# Altium project X-Fly.PrjPcb
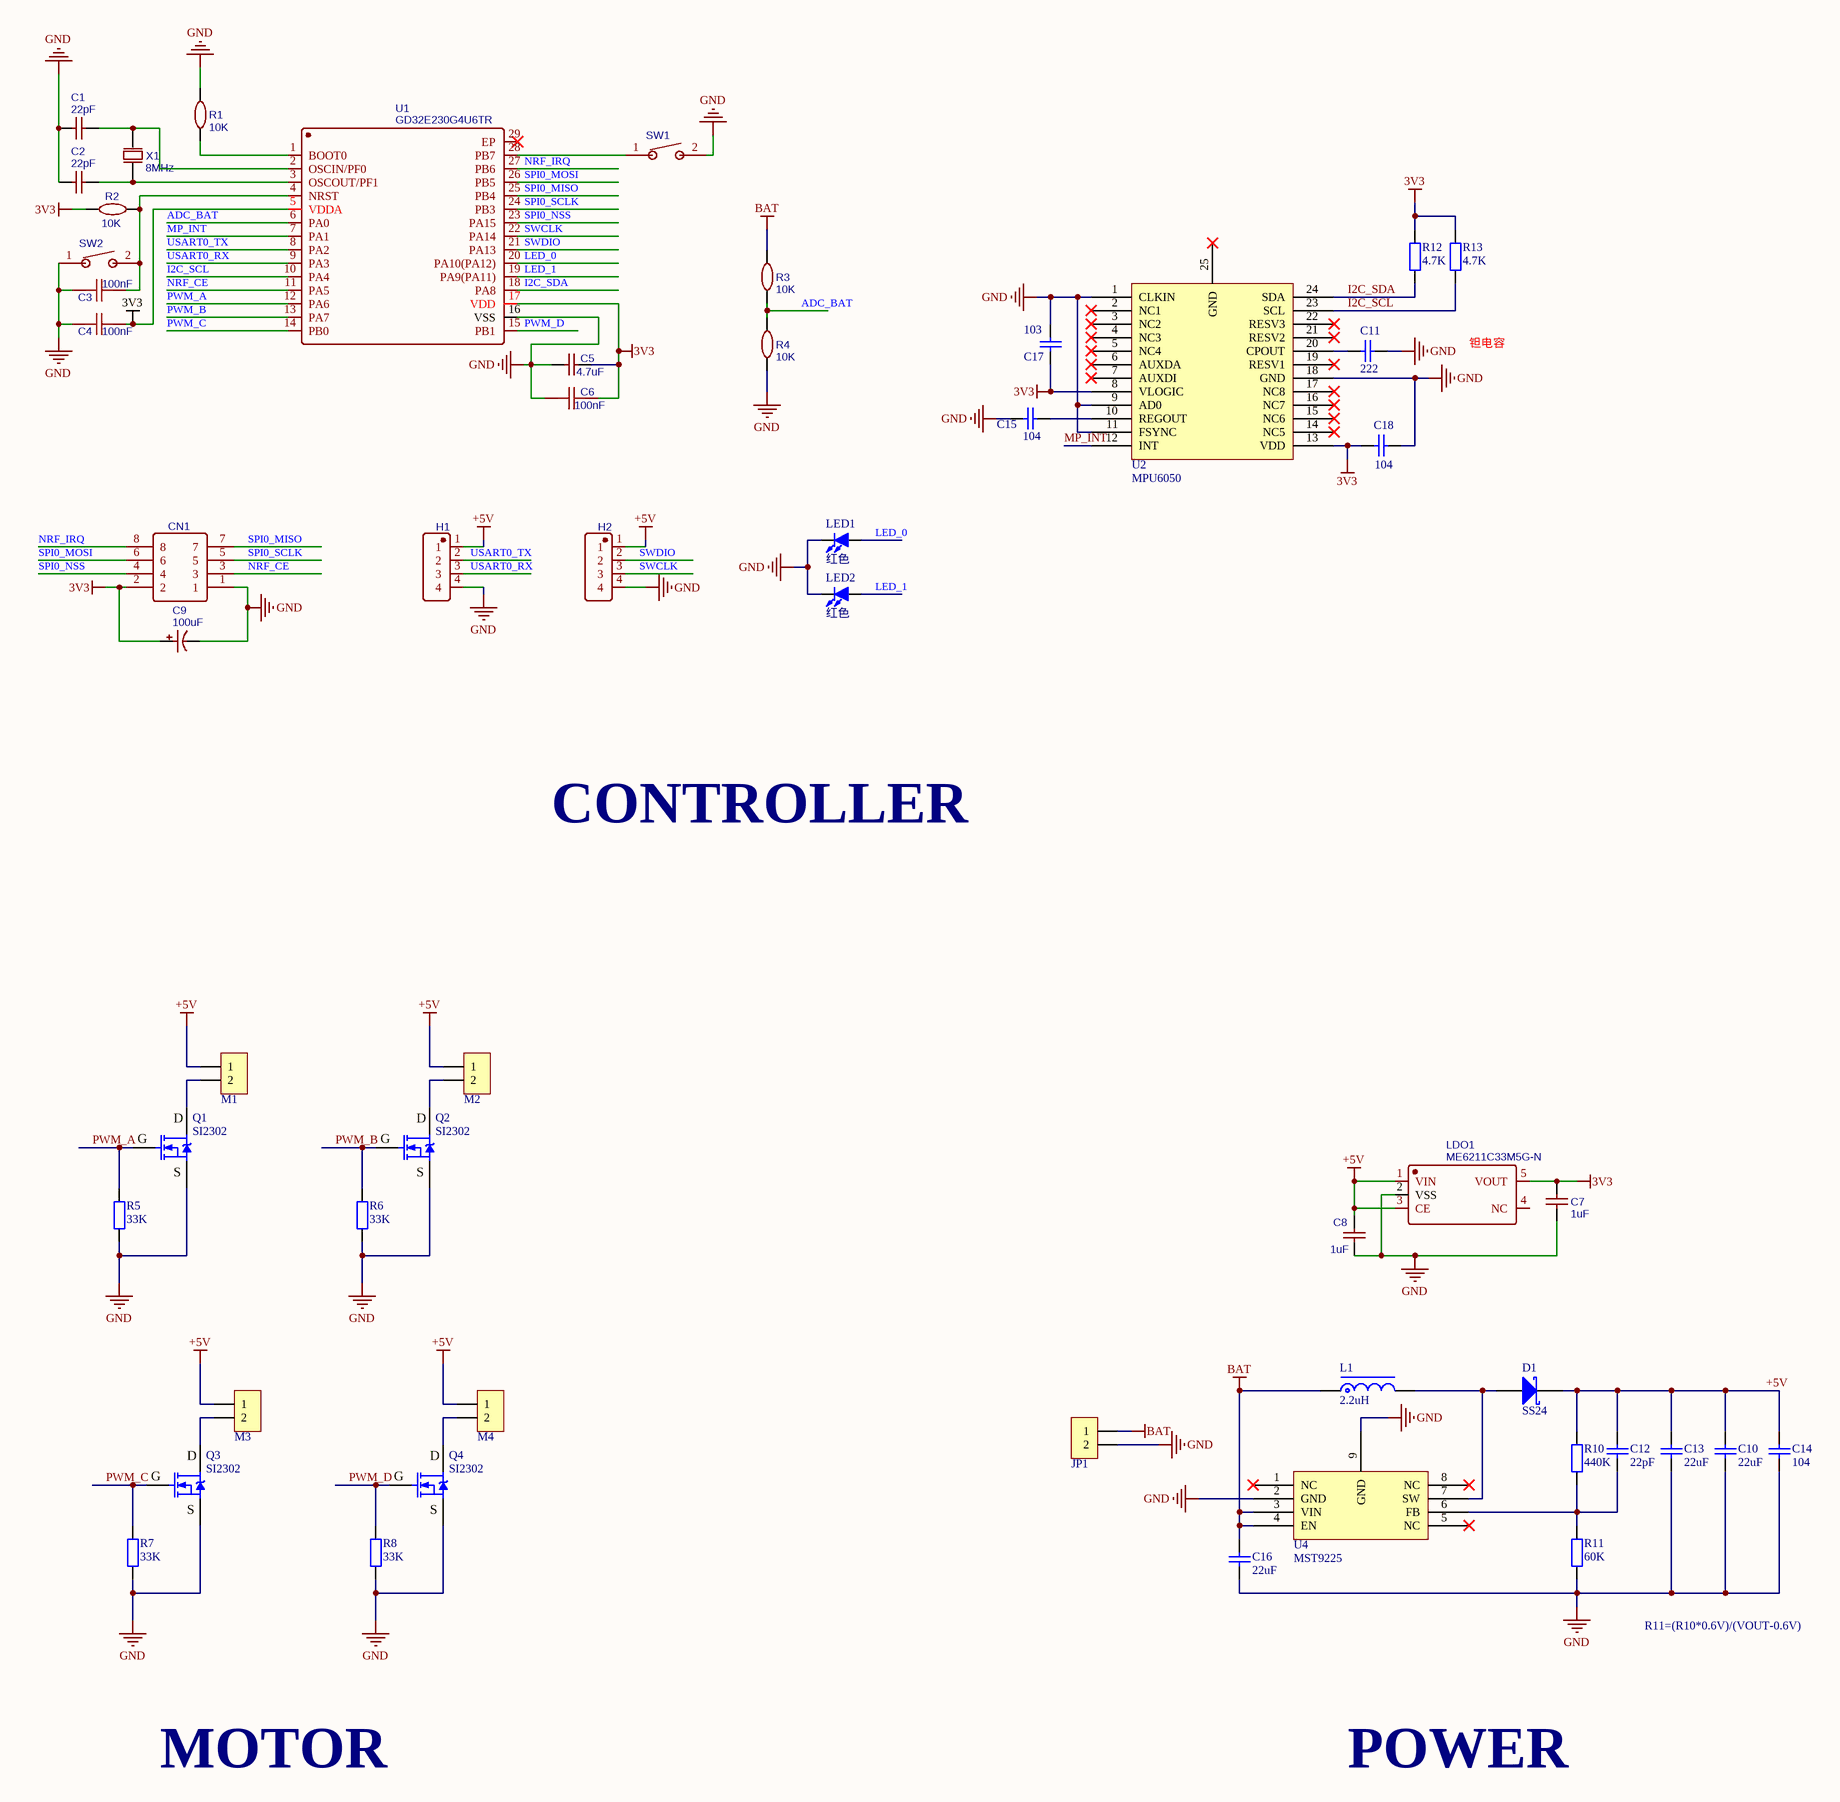
[diagram p0: X-Fly.SchDoc]
1 sheet, 53 parts. Net scope: global (net labels, ports and power ports of the same name join across sheets).
Board file: X-Fly.PcbDoc

## Sheet X-Fly.SchDoc
size A2

### Parts
C1  22pF  [C0603_L]
C2  22pF  [C0603_L]
C3  100nF  [C0603_L]
C4  100nF  [C0603_L]
C5  4.7uF  [C0603_L]
C6  100nF  [C0603_L]
C7  1uF  [C0603_L]
C8  1uF  [C0603_L]
C9  100uF  [CAP 2.5*6.3*11.2-H - BK]
C10  22uF  [C0603_L]
C11  222  [C_3216]
C12  22pF  [C0603_L]
C13  22uF  [C0603_L]
C14  104  [C0603_L]
C15  104  [C0603_L]
C16  22uF  [C0603_L]
C17  103  [C0603_L]
C18  104  [C0603_L]
CN1  A2005WV-2X4P  [.4G无线模块]  (value not drawn)
D1  SS24  [SMB]
H1  1125-1104G0S116C001  [HDR2.54-WI-4P]  (value not drawn)
H2  1125-1104G0S116C001  [HDR2.54-WI-4P]  (value not drawn)
JP1  HDR-1X2  [XH2.54-WI-2P]  (value not drawn)
L1  2.2uH  [CD52]
LDO1  ME6211C33M5G-N  [SOT-23-5]
LED1  红色  [LED0603_R]
LED2  红色  [LED0603_R]
M1  HDR-1X2  [XH2.54-WI-2P]  (value not drawn)
M2  HDR-1X2  [XH2.54-WI-2P]  (value not drawn)
M3  HDR-1X2  [XH2.54-WI-2P]  (value not drawn)
M4  HDR-1X2  [XH2.54-WI-2P]  (value not drawn)
Q1  SI2302  [SOT23-3N]
Q2  SI2302  [SOT23-3N]
Q3  SI2302  [SOT23-3N]
Q4  SI2302  [SOT23-3N]
R1  10K  [R0603_L]
R2  10K  [R0603_L]
R3  10K  [R0603_L]
R4  10K  [R0603_L]
R5  33K  [R0603_L]
R6  33K  [R0603_L]
R7  33K  [R0603_L]
R8  33K  [R0603_L]
R10  440K  [R0603_L]
R11  60K  [R0603_L]
R12  4.7K  [R0603_L]
R13  4.7K  [R0603_L]
SW1  TSA363G25-250B  [SW SMD-3*6*5]  (value not drawn)
SW2  TSA363G25-250B  [SW SMD-3*6*5]  (value not drawn)
U1  GD32E230G4U6TR  [QFN28 5x5_M]
U2  MPU6050  [QFN24 4x4_N]
U4  MST9225  [ESOP8_N]
X1  8MHz  [OSC 5032-2P]

### Nets
3V3: C4.2 C5.1 C6.2 C7.2 C9.1 C17.1 C18.1 CN1.2 LDO1.5(VOUT) R2.2 R12.2 R13.2 U1.5(VDDA) U1.17(VDD) U2.8(VLOGIC) U2.13(VDD)
+5V: C8.2 C10.2 C12.2 C13.2 C14.2 D1.2(K) H1.1 H2.1 LDO1.1(VIN) LDO1.3(CE) M1.1 M2.1 M3.1 M4.1 R10.2
BAT: C16.2 JP1.1 L1.1 R3.1 U4.3(VIN) U4.4(EN)
GND: C1.1 C2.1 C3.2 C4.1 C5.2 C6.1 C7.1 C8.1 C9.2 C10.1 C11.1 C13.1 C14.1 C15.2 C16.1 C17.2 C18.2 CN1.1 H1.4 H2.4 JP1.2 LDO1.2(VSS) LED1.2(K) LED2.2(K) Q1.2(S) Q2.2(S) Q3.2(S) Q4.2(S) R1.2 R4.2 R5.1 R6.1 R7.1 R8.1 R11.1 SW1.2 SW2.1 U1.16(VSS) U2.1(CLKIN) U2.9(AD0) U2.11(FSYNC) U2.18(GND) U4.2(GND) U4.9(GND)
ADC_BAT: R3.2 R4.1 U1.6(PA0)
I2C_SCL: R13.1 U1.10(PA4) U2.23(SCL)
I2C_SDA: R12.1 U1.18(PA8) U2.24(SDA)
LED_0: LED1.1(A) U1.20(PA10(PA12))
LED_1: LED2.1(A) U1.19(PA9(PA11))
MP_INT: U1.7(PA1) U2.12(INT)
NRF_CE: CN1.3 U1.11(PA5)
NRF_IRQ: CN1.8 U1.27(PB6)
PWM_A: Q1.1(G) R5.2 U1.12(PA6)
PWM_B: Q2.1(G) R6.2 U1.13(PA7)
PWM_C: Q3.1(G) R7.2 U1.14(PB0)
PWM_D: Q4.1(G) R8.2 U1.15(PB1)
SPI0_MISO: CN1.7 U1.25(PB4)
SPI0_MOSI: CN1.6 U1.26(PB5)
SPI0_NSS: CN1.4 U1.23(PA15)
SPI0_SCLK: CN1.5 U1.24(PB3)
SWCLK: H2.3 U1.22(PA14)
SWDIO: H2.2 U1.21(PA13)
USART0_RX: H1.3 U1.9(PA3)
USART0_TX: H1.2 U1.8(PA2)
NetC1_2: C1.2 U1.2(OSCIN/PF0) X1.2(OSC2)
NetC2_2: C2.2 U1.3(OSCOUT/PF1) X1.1(OSC1)
NetC3_1: C3.1 R2.1 SW2.2 U1.4(NRST)
NetC11_2: C11.2 U2.20(CPOUT)
NetC12_1: C12.1 R10.1 R11.2 U4.6(FB)
NetC15_1: C15.1 U2.10(REGOUT)
NetD1_1: D1.1(A) L1.2 U4.7(SW)
NetM1_2: M1.2 Q1.3(D)
NetM2_2: M2.2 Q2.3(D)
NetM3_2: M3.2 Q3.3(D)
NetM4_2: M4.2 Q4.3(D)
NetR1_1: R1.1 U1.1(BOOT0)
NetSW1_1: SW1.1 U1.28(PB7)

Not connected (* = marked no-connect by the designer): LDO1 4(NC); U1 29(EP)*; U2 2(NC1)* 3(NC2)* 4(NC3)* 5(NC4)* 6(AUXDA)* 7(AUXDI)* 14(NC5)* 15(NC6)* 16(NC7)* 17(NC8)* 19(RESV1)* 21(RESV2)* 22(RESV3)* 25(GND)*; U4 1(NC)* 5(NC)* 8(NC)*

### Notes on the sheet
- 钽电容
- CONTROLLER
- R11=(R10*0.6V)/(VOUT-0.6V)
- MOTOR
- POWER

### Library data of the parts
C1 C2 = 22pF: BOM_Manufacturer: YAGEO; BOM_Manufacturer Part: CC0603JRNPO9BN220; nameAlias: Capacitance; BOM_Supplier: LCSC; BOM_Supplier Part: C105620; BOM_JLCPCB Part Class: Extended Part; spicePre: C; spiceSymbolName: CC0603JRNPO9BN220
C3 C4 C6 = 100nF: BOM_Manufacturer: YAGEO; BOM_Manufacturer Part: CC0603KRX7R9BB104; nameAlias: Capacitance; BOM_Supplier: LCSC; BOM_Supplier Part: C14663; BOM_JLCPCB Part Class: Basic Part; spicePre: C; spiceSymbolName: CC0603KRX7R9BB104
C5 = 4.7uF: BOM_Manufacturer Part: CL10A475KO8NNNC; BOM_Manufacturer: SAMSUNG; nameAlias: Capacitance; BOM_Supplier: LCSC; BOM_Supplier Part: C19666; BOM_JLCPCB Part Class: Basic Part; spicePre: C; spiceSymbolName: CL10A475KO8NNNC
C7 C8 = 1uF: BOM_Manufacturer Part: CL10A105KB8NNNC; BOM_Manufacturer: SAMSUNG; nameAlias: Capacitance; BOM_Supplier: LCSC; BOM_Supplier Part: C15849; BOM_JLCPCB Part Class: Basic Part; spicePre: C; spiceSymbolName: CL10A105KB8NNNC
C9 = 100uF: BOM_Manufacturer: Rubycon; BOM_Manufacturer Part: 35YXJ100M6.3X11; nameAlias: Capacitance; BOM_Supplier: LCSC; BOM_Supplier Part: C88754; BOM_JLCPCB Part Class: Extended Part; spicePre: C; spiceSymbolName: 35YXJ100M6.3X11
C10-C18 = C: 贴片电容; BOM名称: 无极性贴片电容; 联系卖家，免费查找封装: 唯一出售店铺网址https://shop463601444.taobao.com
CN1 = A2005WV-2X4P: BOM_Manufacturer: Changjiang Connectors; Contributor: LCSC; BOM_Supplier: LCSC; BOM_Supplier Part: C225289; BOM_Manufacturer Part: A2005WV-2x4P; BOM_JLCPCB Part Class: Extended Part; spicePre: C; spiceSymbolName: A2005WV-2X4P
D1 = SS24: 肖特基二极管; 属性: 40V/2A; 联系卖家，免费查找封装: 唯一出售店铺网址https://shop463601444.taobao.com; BOM名称: 肖特基二极管
H1 H2 = 1125-1104G0S116C001: BOM_Manufacturer: Wcon(维峰电子); Contributor: LCSC; BOM_Supplier: LCSC; BOM_Supplier Part: C920779; BOM_Manufacturer Part: 1125-1104G0S116C001; spicePre: H; spiceSymbolName: 1125-1104G0S116C001
JP1 M1-M4 = Header 2: 2P接插件; 封装库来自淘宝卖家 ID：黄晶宝石: 其他店铺购入均为盗版假冒封装库; 联系卖家，免费查找封装: 唯一出售店铺网址https://shop463601444.taobao.com; BOM名称: 2P接插件
L1 = L-NR: 太诱-NR磁胶电感; BOM名称: NR磁胶电感; 联系卖家，免费查找封装: 唯一出售店铺网址https://shop463601444.taobao.com; 封装库来自淘宝卖家ID：黄晶宝石: 其他店铺购入均为盗版假冒封装库，请立即申请退款
LDO1 = ME6211C33M5G-N: BOM_Manufacturer: MICRONE; BOM_Supplier: LCSC; BOM_Manufacturer Part: ME6211C33M5G-N; BOM_Supplier Part: C82942; BOM_JLCPCB Part Class: Extended Part; spicePre: L; spiceSymbolName: ME6211C33M5G-N
LED1 LED2 = LED-SMD: 贴片LED; 封装库来自淘宝卖家 ID：黄晶宝石: 其他店铺购入均为假冒，请立即申请退款，本店奖励现金5~20元; BOM名称: 贴片LED
Q1-Q4 = SI2302: N沟道 20V/3A; BOM名称: N沟道场效应管; 联系卖家，免费查找封装: 唯一出售店铺网址https://shop463601444.taobao.com; 封装库来自淘宝卖家 ID：黄晶宝石: 其他店铺购入均为盗版，不享受售后技术支持服务，请立即申请退款
R1-R4 = 10K: BOM_Manufacturer: YAGEO; BOM_Manufacturer Part: RC0603FR-0710KL; nameAlias: Resistance (Ohms); BOM_Supplier: LCSC; BOM_Supplier Part: C98220; BOM_JLCPCB Part Class: Extended Part; spicePre: R; spiceSymbolName: RC0603FR-0710KL
R5-R8 R10-R13 = R: 贴片电阻; 联系卖家，免费查找封装: 唯一出售店铺网址https://shop463601444.taobao.com; 封装库来自淘宝卖家ID：黄晶宝石: 其他店铺购入均为盗版假冒封装库，请立即申请退款; BOM名称: 贴片电阻
SW1 SW2 = TSA363G25-250B: BOM_Manufacturer: BRIGHT; Contributor: LCSC; BOM_Supplier: LCSC; BOM_Supplier Part: C354943; BOM_Manufacturer Part: TSA363G25-250B; BOM_JLCPCB Part Class: Extended Part; spicePre: S; spiceSymbolName: TSA363G25-250B
U1 = GD32E230G4U6TR: BOM_Manufacturer: GigaDevice Semicon Beijing; Contributor: LCSC; BOM_Supplier: LCSC; BOM_Supplier Part: C380784; BOM_Manufacturer Part: GD32E230G4U6TR; BOM_JLCPCB Part Class: Extended Part; spicePre: U; spiceSymbolName: GD32E230G4U6TR
U4 = MST9225: 单节锂电池2A升压芯片
X1 = 8MHz: BOM_Manufacturer: Zhejiang Abel Elec; nameAlias: Frequency; Contributor: LCSC; BOM_Supplier: LCSC; BOM_Supplier Part: C122522; BOM_Manufacturer Part: -; BOM_JLCPCB Part Class: Extended Part; spicePre: X; spiceSymbolName: SMD-5032_2P 8M 20pf 30ppm